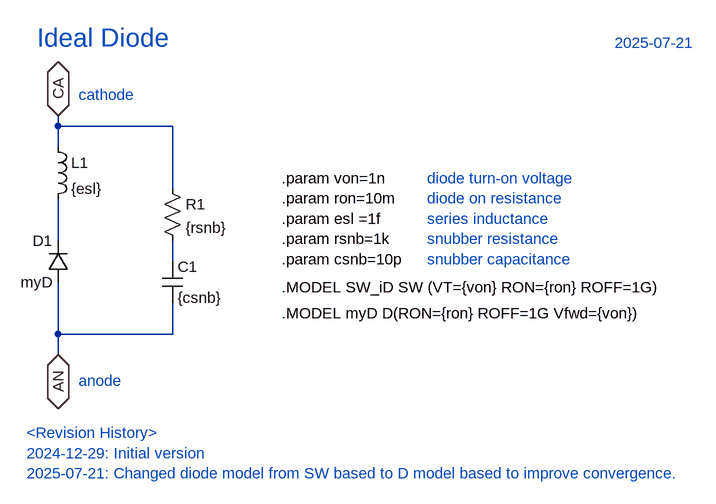
[diagram p0: schematic iD.asc]
iD.asc, the LTspice schematic file:
Version 4.1
SHEET 1 1728 680
WIRE 624 -288 624 -304
WIRE 800 -288 624 -288
WIRE 624 -256 624 -288
WIRE 800 -192 800 -288
WIRE 624 -112 624 -176
WIRE 800 -80 800 -112
WIRE 624 32 624 -48
WIRE 800 32 800 -16
WIRE 800 32 624 32
WIRE 624 64 624 32
FLAG 624 -304 CA
IOPIN 624 -304 BiDir
FLAG 624 64 AN
IOPIN 624 64 BiDir
SYMBOL res 784 -208 R0
SYMATTR InstName R1
SYMATTR Value {rsnb}
SYMBOL cap 784 -80 R0
SYMATTR InstName C1
SYMATTR Value {csnb}
SYMBOL ind 608 -272 R0
SYMATTR InstName L1
SYMATTR Value {esl}
SYMBOL diode 640 -48 R180
WINDOW 0 24 64 Left 2
WINDOW 3 24 0 Left 2
SYMATTR InstName D1
SYMATTR Value myD
TEXT 968 -40 Left 2 !.MODEL SW_iD SW (VT={von} RON={ron} ROFF=1G)
TEXT 968 -208 Left 2 !.param von=1n\n.param ron=10m\n.param esl =1f\n.param rsnb=1k\n.param csnb=10p
TEXT 592 -424 Left 4 ;Ideal Diode
TEXT 656 -336 Left 2 ;cathode
TEXT 656 104 Left 2 ;anode
TEXT 1192 -208 Left 2 ;diode turn-on voltage\ndiode on resistance\nseries inductance\nsnubber resistance\nsnubber capacitance
TEXT 1480 -416 Left 2 ;2025-07-21
TEXT 576 184 Left 2 ;<Revision History>\n2024-12-29: Initial version\n2025-07-21: Changed diode model from SW based to D model based to improve convergence.
TEXT 968 0 Left 2 !.MODEL myD D(RON={ron} ROFF=1G Vfwd={von})

The netlist it stands for:
* iD.asc
R1 CA N002 {rsnb}
C1 N002 AN {csnb}
L1 CA N001 {esl}
D1 AN N001 myD
.model D D
.lib standard.dio
.MODEL SW_iD SW (VT={von} RON={ron} ROFF=1G)
.param von=1n
.param ron=10m
.param esl =1f
.param rsnb=1k
.param csnb=10p
* Ideal Diode
* cathode
* anode
* diode turn-on voltage
* diode on resistance
* series inductance
* snubber resistance
* snubber capacitance
* 2025-07-21
* <Revision History>
* 2024-12-29: Initial version
* 2025-07-21: Changed diode model from SW based to D model based to improve convergence.
.MODEL myD D(RON={ron} ROFF=1G Vfwd={von})
.backanno
.end